# Altium project VOM.PrjPCB
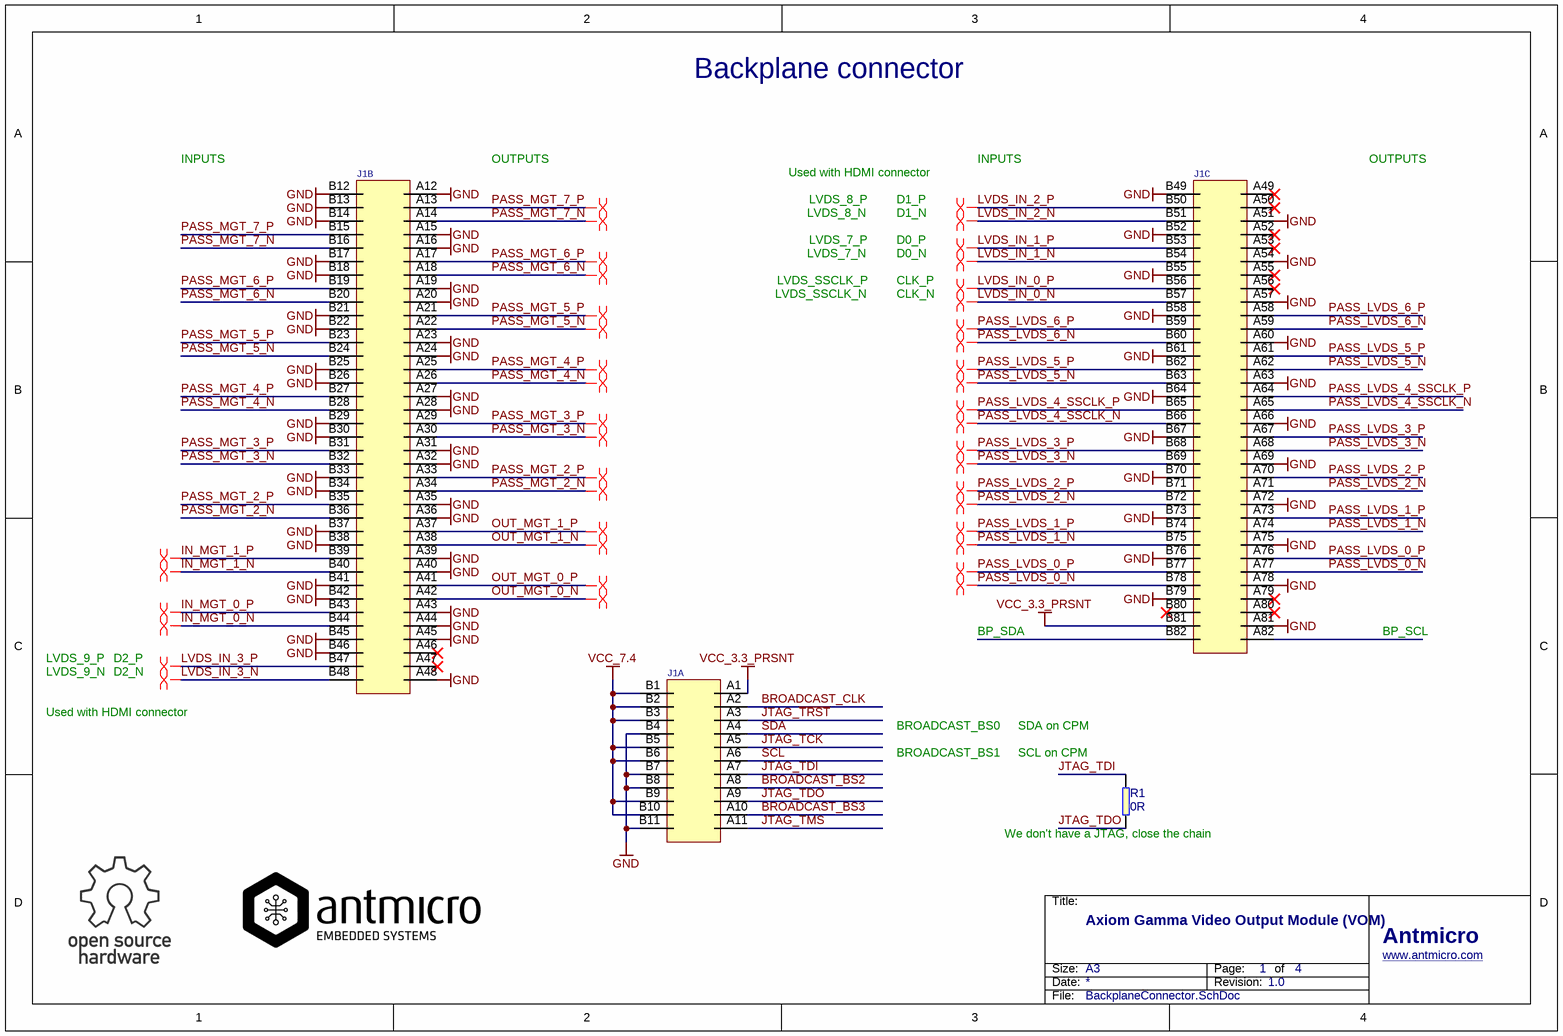
[diagram p0: BackplaneConnector.SchDoc]
AM_Author: H. Szwed, P. Katarzynski, M. Majchrzycki; AM_Revision: 1.0; AM_Title: Axiom Gamma Video Output Module (VOM)
4 sheets, 103 parts. Net scope: global (net labels, ports and power ports of the same name join across sheets).
Board file: PCB.PcbDoc
Sheets:
  BackplaneConnector.SchDoc
  Supplies.SchDoc
  HDMI.SchDoc
  SDI.SchDoc

## Sheet BackplaneConnector.SchDoc
size A4; DocumentNumber: 1; SheetNumber: 1; SheetTotal: 4; PageSetup: Record=PageOptions|CenterHorizontal=True|CenterVertical=True|PrintScale=0.97|XCorrection=1.00|YCorrection=1.00|PrintKind=1|BorderSize=5000000|LeftOffset=0|BottomOffset=0|Orientation=2|PaperLength=2970|PaperWidth=2100|Scale=100|PaperSource=7|PrintQuality=600|MediaType=1|DitherType=10|PaperKind=A4|PrintScaleMode=1

### Parts
J1  (no value)  [PCIEX16]  (parts A,B,C of 3)  (no BOM)
R1  0R  [0402]

### Nets
GND: J1.A12 J1.A15 J1.A16 J1.A19 J1.A20 J1.A23 J1.A24 J1.A27 J1.A28 J1.A31 J1.A32 J1.A35 J1.A36 J1.A39 J1.A40 J1.A43 J1.A44 J1.A45 J1.A48 J1.A51 J1.A54 J1.A57 J1.A60 J1.A63 J1.A66 J1.A69 J1.A72 J1.A75 J1.A78 J1.A81 J1.B4 J1.B7 J1.B8 J1.B11 J1.B12 J1.B13 J1.B14 J1.B17 J1.B18 J1.B21 J1.B22 J1.B25 J1.B26 J1.B29 J1.B30 J1.B33 J1.B34 J1.B37 J1.B38 J1.B41 J1.B42 J1.B45 J1.B46 J1.B49 J1.B52 J1.B55 J1.B58 J1.B61 J1.B64 J1.B67 J1.B70 J1.B73 J1.B76 J1.B79
VCC_3.3_PRSNT: J1.A1 J1.B81
VCC_7.4: J1.B1 J1.B2 J1.B3 J1.B5 J1.B6 J1.B9 J1.B10
BROADCAST_BS2: J1.A8
BROADCAST_BS3: J1.A10
BROADCAST_CLK: J1.A2
IN_MGT_0_N: J1.B44
IN_MGT_0_P: J1.B43
IN_MGT_1_N: J1.B40
IN_MGT_1_P: J1.B39
JTAG_~{TRST}: J1.A3
JTAG_TCK: J1.A5
JTAG_TDI: J1.A7 R1.2
JTAG_TDO: J1.A9 R1.1
JTAG_TMS: J1.A11
LVDS_IN_0_N: J1.B57
LVDS_IN_0_P: J1.B56
LVDS_IN_1_N: J1.B54
LVDS_IN_1_P: J1.B53
LVDS_IN_2_N: J1.B51
LVDS_IN_2_P: J1.B50
LVDS_IN_3_N: J1.B48
LVDS_IN_3_P: J1.B47
OUT_MGT_0_N: J1.A42
OUT_MGT_0_P: J1.A41
OUT_MGT_1_N: J1.A38
OUT_MGT_1_P: J1.A37
PASS_LVDS_0_N: J1.A77 J1.B78
PASS_LVDS_0_P: J1.A76 J1.B77
PASS_LVDS_1_N: J1.A74 J1.B75
PASS_LVDS_1_P: J1.A73 J1.B74
PASS_LVDS_2_N: J1.A71 J1.B72
PASS_LVDS_2_P: J1.A70 J1.B71
PASS_LVDS_3_N: J1.A68 J1.B69
PASS_LVDS_3_P: J1.A67 J1.B68
PASS_LVDS_4_SSCLK_N: J1.A65 J1.B66
PASS_LVDS_4_SSCLK_P: J1.A64 J1.B65
PASS_LVDS_5_N: J1.A62 J1.B63
PASS_LVDS_5_P: J1.A61 J1.B62
PASS_LVDS_6_N: J1.A59 J1.B60
PASS_LVDS_6_P: J1.A58 J1.B59
PASS_MGT_2_N: J1.A34 J1.B36
PASS_MGT_2_P: J1.A33 J1.B35
PASS_MGT_3_N: J1.A30 J1.B32
PASS_MGT_3_P: J1.A29 J1.B31
PASS_MGT_4_N: J1.A26 J1.B28
PASS_MGT_4_P: J1.A25 J1.B27
PASS_MGT_5_N: J1.A22 J1.B24
PASS_MGT_5_P: J1.A21 J1.B23
PASS_MGT_6_N: J1.A18 J1.B20
PASS_MGT_6_P: J1.A17 J1.B19
PASS_MGT_7_N: J1.A14 J1.B16
PASS_MGT_7_P: J1.A13 J1.B15
SCL: J1.A6
SDA: J1.A4

Not connected (* = marked no-connect by the designer): J1 A46* A47* A49* A50* A52* A53* A55* A56* A79* A80* A82 B80* B82

### Layout directives
differential pair: IN_MGT_0_N, IN_MGT_0_P, IN_MGT_1_N, IN_MGT_1_P, LVDS_IN_0_N, LVDS_IN_0_P, LVDS_IN_1_N, LVDS_IN_1_P, LVDS_IN_2_N, LVDS_IN_2_P, LVDS_IN_3_N, LVDS_IN_3_P, OUT_MGT_0_N, OUT_MGT_0_P, OUT_MGT_1_N, OUT_MGT_1_P, PASS_LVDS_0_N, PASS_LVDS_0_P, PASS_LVDS_1_N, PASS_LVDS_1_P, PASS_LVDS_2_N, PASS_LVDS_2_P, PASS_LVDS_3_N, PASS_LVDS_3_P, PASS_LVDS_4_SSCLK_N, PASS_LVDS_4_SSCLK_P, PASS_LVDS_5_N, PASS_LVDS_5_P, PASS_LVDS_6_N, PASS_LVDS_6_P, PASS_MGT_2_N, PASS_MGT_2_P, PASS_MGT_3_N, PASS_MGT_3_P, PASS_MGT_4_N, PASS_MGT_4_P, PASS_MGT_5_N, PASS_MGT_5_P, PASS_MGT_6_N, PASS_MGT_6_P, PASS_MGT_7_N, PASS_MGT_7_P

### Notes on the sheet
- Backplane connector
- INPUTS
- OUTPUTS
- Used with HDMI connector
- LVDS_8_N
- LVDS_8_P
- LVDS_7_P
- D1_N
- D1_P
- D0_P
- LVDS_SSCLK_N
- LVDS_SSCLK_P
- LVDS_7_N
- CLK_N
- CLK_P
- D0_N
- BP_SDA
- BP_SCL
- LVDS_9_P
- LVDS_9_N
- D2_P
- D2_N
- BROADCAST_BS0
- BROADCAST_BS1
- SDA on CPM
- SCL on CPM
- (near R1) We don't have a JTAG, close the chain
- Title:
- Size:
- Date:
- A3
- Revision:
- Page:
- of
- Antmicro
- www.antmicro.com
- File:

### Library data of the parts
J1 = PCIEX16: PCB Only; Part Number: PCIEX16; Manufacturer: PCB ONLY; Part Symbol: PCB ONLY
R1 = R_0R_0402: SMT Resistor 0402; Manufacturer: MULTICOMP; Part Symbol: MCMR04X000 PTL; Value: 0R; Part Number: R_0R_0402

## Sheet Supplies.SchDoc
size A4; DocumentNumber: 2; SheetNumber: 2; SheetTotal: 4; PageSetup: Record=PageOptions|CenterHorizontal=True|CenterVertical=True|PrintScale=0.97|XCorrection=1.00|YCorrection=1.00|PrintKind=1|BorderSize=5000000|LeftOffset=0|BottomOffset=0|Orientation=2|PaperLength=2970|PaperWidth=2100|Scale=100|PaperSource=7|PrintQuality=600|MediaType=1|DitherType=10|PaperKind=A4|PrintScaleMode=1
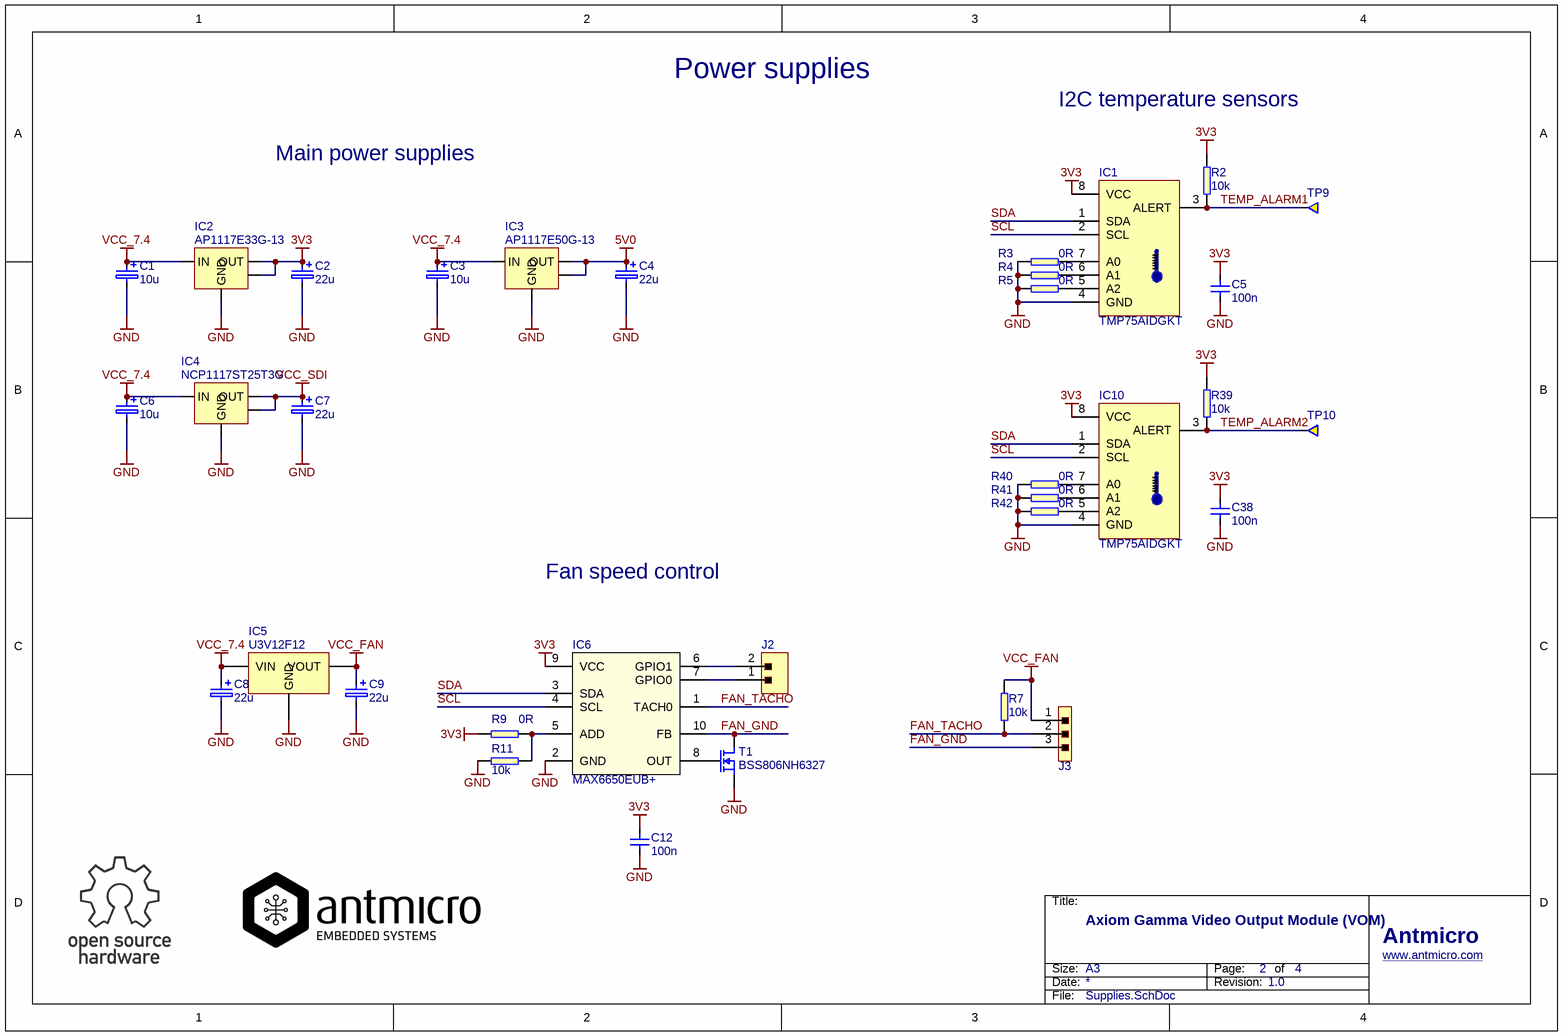
[diagram p1: Supplies.SchDoc]

### Parts
C1  10u  [KEMET_C]
C2  22u  [KEMET_C]
C3  10u  [KEMET_C]
C4  22u  [KEMET_C]
C5  100n  [0402]
C6  10u  [KEMET_C]
C7  22u  [KEMET_C]
C8  22u  [KEMET_C]
C9  22u  [KEMET_C]
C12  100n  [0402]
C38  100n  [0402]
IC1  TMP75AIDGKT  [MSOP-8]
IC2  AP1117E33G-13  [SOT223]
IC3  AP1117E50G-13  [SOT223]
IC4  NCP1117ST25T3G  [SOT223]
IC5  U3V12F12  [U3V12Fxx]
IC6  MAX6650EUB+  [uMAX10]
IC10  TMP75AIDGKT  [MSOP-8]
J2  MH_1X02_2.54  [MH_1X02_2.54]  (value not drawn)
J3  Molex 022232031  [molex_2223-2031]  (value not drawn)
R2  10k  [0402]
R3  0R  [0603]
R4  0R  [0603]
R5  0R  [0603]
R7  10k  [0402]
R9  0R  [0603]
R11  10k  [0603]
R39  10k  [0402]
R40  0R  [0603]
R41  0R  [0603]
R42  0R  [0603]
T1  BSS806NH6327  [SOT-23]
TP9  Testpad  [Testpad]  (value not drawn)  (no BOM)
TP10  Testpad  [Testpad]  (value not drawn)  (no BOM)

### Nets
3V3: C2.1 C5.1 C12.1 C38.1 IC1.8(VCC) IC2.2(OUT) IC2.4(OUT) IC6.9(VCC) IC10.8(VCC) R2.2 R9.1 R39.2
5V0: C4.1 IC3.2(OUT) IC3.4(OUT)
GND: C1.2 C2.2 C3.2 C4.2 C5.2 C6.2 C7.2 C8.2 C9.2 C12.2 C38.2 IC1.4(GND) IC2.1(GND) IC3.1(GND) IC4.1(GND) IC5.2(GND) IC6.2(GND) IC10.4(GND) R3.2 R4.2 R5.2 R11.1 R40.2 R41.2 R42.2 T1.2(S)
VCC_7.4: C1.1 C3.1 C6.1 C8.1 IC2.3(IN) IC3.3(IN) IC4.3(IN) IC5.1(VIN)
VCC_FAN: C9.1 IC5.3(VOUT) J3.1 R7.2
VCC_SDI: C7.1 IC4.2(OUT) IC4.4(OUT)
FAN_GND: IC6.10(FB) J3.3 T1.3(D)
FAN_TACHO: IC6.1(TACH0) J3.2 R7.1
SCL: IC1.2(SCL) IC6.4(SCL) IC10.2(SCL)
SDA: IC1.1(SDA) IC6.3(SDA) IC10.1(SDA)
TEMP_ALARM1: IC1.3(ALERT) R2.1 TP9.1
TEMP_ALARM2: IC10.3(ALERT) R39.1 TP10.1
NetIC1_5: IC1.5(A2) R5.1
NetIC1_6: IC1.6(A1) R4.1
NetIC1_7: IC1.7(A0) R3.1
NetIC6_5: IC6.5(ADD) R9.2 R11.2
NetIC6_6: IC6.6(GPIO1) J2.2
NetIC6_7: IC6.7(GPIO0) J2.1
NetIC6_8: IC6.8(OUT) T1.1(G)
NetIC10_5: IC10.5(A2) R42.1
NetIC10_6: IC10.6(A1) R41.1
NetIC10_7: IC10.7(A0) R40.1

### Notes on the sheet
- Power supplies
- I2C temperature sensors
- Main power supplies
- Fan speed control
- Title:
- Size:
- Date:
- A3
- Revision:
- Page:
- of
- Antmicro
- www.antmicro.com
- File:

### Library data of the parts
C1 C3 C6 = CPol_10u: Tantalum SMT Capacitor 10uF Case KEMET_C; Part Number: C_10u_KEMET_C; Manufacturer: KEMET; Part Symbol: T491C106K025AT; Value: 10u
C2 C4 C7-C9 = CPol_22u: Tantalum SMT Capacitor 22uF Case KEMET_C; Part Number: C_22u_KEMET_C; Manufacturer: KEMET; Part Symbol: T491C226K025AT; Value: 22u
C5 C12 C38 = C_100n_0402: MLCC SMT Capacitor 0402; Manufacturer: MULTICOMP; Part Symbol: MC0402X104M100CT; Value: 100n; Part Number: C_100n_0402
IC1 IC10 = TMP75: Temperature Sensor With I2C and SMBus Interface in Industry Standard LM75; Manufacturer: TEXAS INSTRUMENTS; Part Number: TMP75AIDGKT; Value: TMP75AIDGKT; Part Symbol: TMP75AIDGKT
IC2 = AP1117E33G-13: IC, LDO, REG, 3.3V, SOT223; Manufacturer: DIODES INC.; Value: AP1117E33G-13; Part Number: AP1117E33G-13; Part Symbol: AP1117E33G-13
IC3 = AP1117E50G-13: IC, LDO, REG, 5.0V, SOT223; Manufacturer: DIODES INC.; Value: AP1117E50G-13; Part Number: AP1117E50G-13; Part Symbol: AP1117E50G-13
IC4 = NCP1117ST25T3G: IC, LDO, REG, 2.5V, SOT223; Manufacturer: ON Semiconductor; Value: NCP1117ST25T3G; Part Number: NCP1117ST25T3G; Part Symbol: NCP1117ST25T3G
IC5 = U3V12F12: Pololu 9V Step-Up Voltage Regulator; Manufacturer: TME; Part Symbol: POLOLU-2117 / POLOLU-2117; Part Number: U3V12F12; Value: U3V12F12
IC6 = MAX6650: Fan-Speed Regulator and Monitor with SMBus/I2C-Compatible Interface; Manufacturer: MAXIM INTEGRATED; Part Number: MAX6650EUB+; Value: MAX6650EUB+; Part Symbol: MAX6650EUB+
J2 = 1X02: Male header, 1 x 02 pins, pitch 2.54 mm; Manufacturer: MULTICOMP; Part Symbol: 2211S-02G; Part Number: MH_1X02_2.54; Value: MH_1X02_2.54
J3 = 1X03: Part Number: molex_2223-2031; Value: Molex 022232031; Manufacturer: Molex; Part Symbol: 22-23-2031
R2 R7 R39 = R_10k_0402: SMT Resistor 0402; Manufacturer: MULTICOMP; Part Symbol: MCMR04X1002FTL; Value: 10k; Part Number: R_10k_0402
R3-R5 R9 R40-R42 = R_0R_0603: SMT Resistor 0R 0603; Manufacturer: BOURNS; Part Symbol: CR0603-J/-000ELF; Value: 0R; Part Number: R_0R_0603
R11 = R_10k_0603: SMT Resistor 0R 0603; Manufacturer: BOURNS; Part Symbol: CR0603-JW-103ELF; Value: 10k; Part Number: R_10k_0603
T1 = BSS806NH6327: MOSFET, BRT, N CH, 2.3 A, 20 V, 0.041 ohm, 2.5 V, 550 mV; Manufacturer: INFINEON; Part Symbol: BSS806NH6327XTSA1; Value: BSS806NH6327; Part Number: BSS806NH6327
TP9 TP10 = Testpad: Testpad 2mm diameter; Manufacturer: PCB ONLY; Part Number: Testpad; Part Symbol: PCB ONLY

## Sheet HDMI.SchDoc
size A4; DocumentNumber: 3; SheetNumber: 3; SheetTotal: 4; PageSetup: Record=PageOptions|CenterHorizontal=True|CenterVertical=True|PrintScale=0.97|XCorrection=1.00|YCorrection=1.00|PrintKind=1|BorderSize=5000000|LeftOffset=0|BottomOffset=0|Orientation=2|PaperLength=2970|PaperWidth=2100|Scale=100|PaperSource=7|PrintQuality=600|MediaType=1|DitherType=10|PaperKind=A4|PrintScaleMode=1
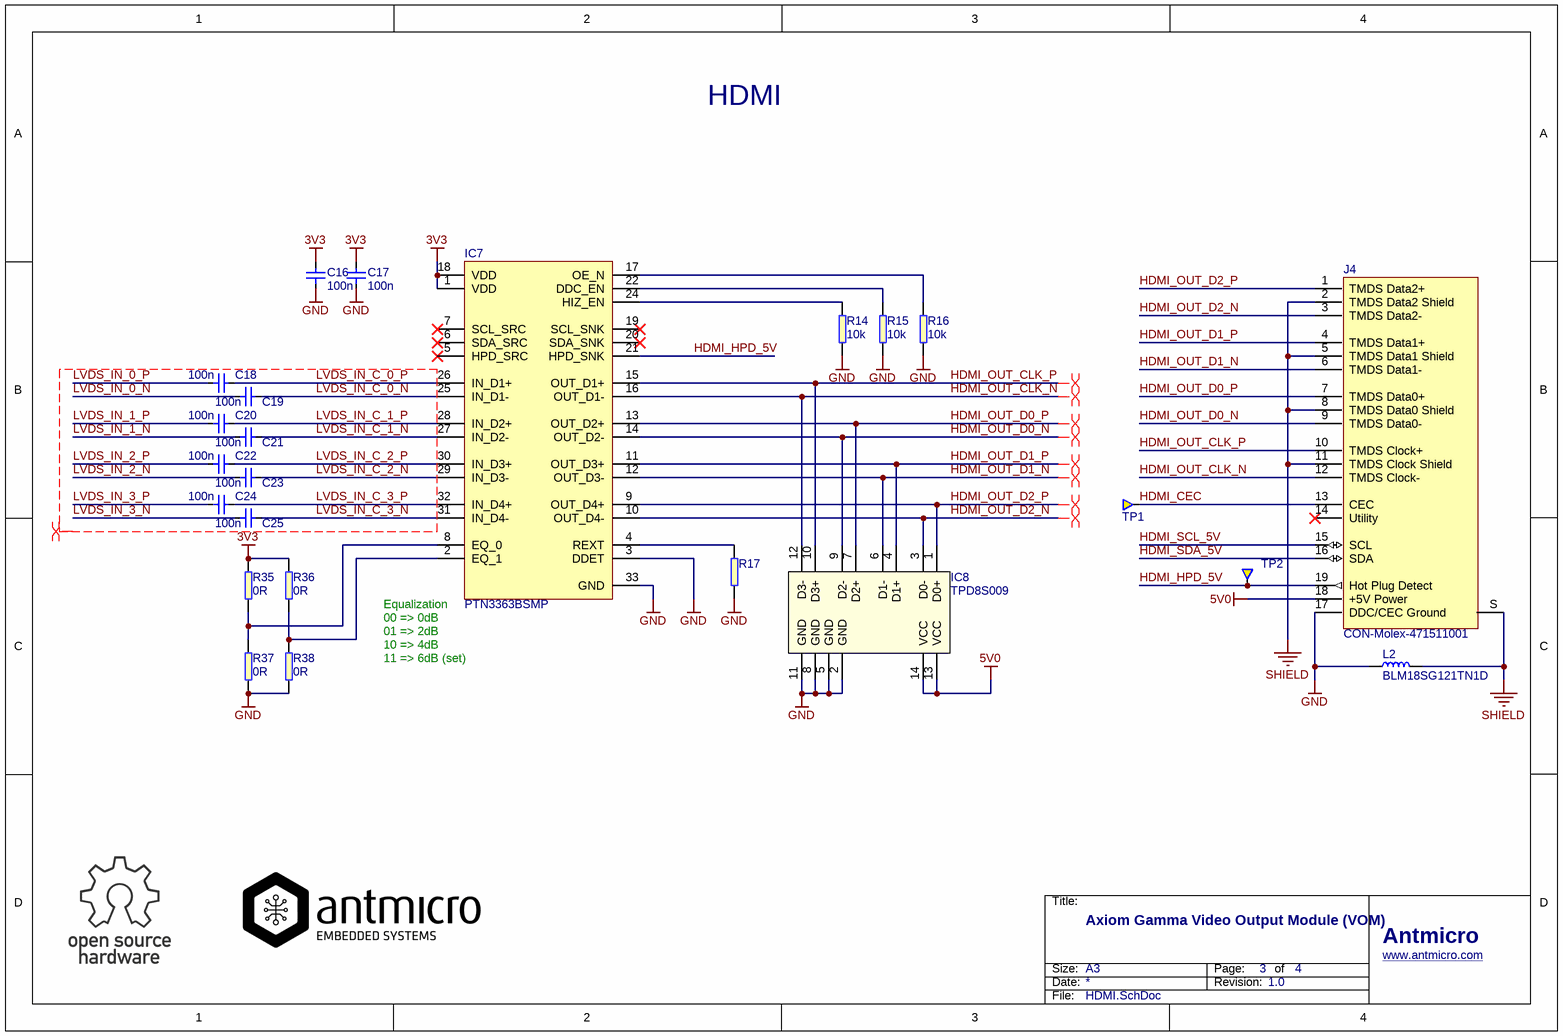
[diagram p2: HDMI.SchDoc]

### Parts
C16  100n  [0402]
C17  100n  [0402]
C18  100n  [0402]
C19  100n  [0402]
C20  100n  [0402]
C21  100n  [0402]
C22  100n  [0402]
C23  100n  [0402]
C24  100n  [0402]
C25  100n  [0402]
IC7  PTN3363BSMP  [QFN-32]
IC8  TPD8S009  [SON-15]
J4  CON-Molex-471511001  [Molex_HDMI_471511001]
L2  BLM18SG121TN1D  [0603]
R14  10k  [0402]
R15  10k  [0402]
R16  10k  [0402]
R17  12k4  [0402]  (value not drawn)
R35  0R  [0603]
R36  0R  [0603]
R37  0R  [0603]
R38  0R  [0603]
TP1  Testpad  [Testpad]  (value not drawn)  (no BOM)
TP2  Testpad  [Testpad]  (value not drawn)  (no BOM)

### Nets
3V3: C16.2 C17.2 IC7.1(VDD) IC7.18(VDD) R35.1 R36.1
5V0: IC8.13(VCC) IC8.14(VCC) J4.18(+5V_Power)
GND: C16.1 C17.1 IC7.3(DDET) IC7.33(GND) IC8.2(GND) IC8.5(GND) IC8.8(GND) IC8.11(GND) J4.17(DDC/CEC_Ground) L2.1 R14.2 R15.2 R16.2 R17.1 R37.2 R38.2
SHIELD: J4.2(TMDS_Data2_Shield) J4.5(TMDS_Data1_Shield) J4.8(TMDS_Data0_Shield) J4.11(TMDS_Clock_Shield) J4.S(SH) L2.2
HDMI_CEC: J4.13(CEC) TP1.1
HDMI_HPD_5V: IC7.21(HPD_SNK) J4.19(Hot_Plug_Detect) TP2.1
HDMI_OUT_CLK_N: IC7.16(OUT_D1-) IC8.12(D3-) J4.12(TMDS_Clock-)
HDMI_OUT_CLK_P: IC7.15(OUT_D1+) IC8.10(D3+) J4.10(TMDS_Clock+)
HDMI_OUT_D0_N: IC7.14(OUT_D2-) IC8.9(D2-) J4.9(TMDS_Data0-)
HDMI_OUT_D0_P: IC7.13(OUT_D2+) IC8.7(D2+) J4.7(TMDS_Data0+)
HDMI_OUT_D1_N: IC7.12(OUT_D3-) IC8.6(D1-) J4.6(TMDS_Data1-)
HDMI_OUT_D1_P: IC7.11(OUT_D3+) IC8.4(D1+) J4.4(TMDS_Data1+)
HDMI_OUT_D2_N: IC7.10(OUT_D4-) IC8.3(D0-) J4.3(TMDS_Data2-)
HDMI_OUT_D2_P: IC7.9(OUT_D4+) IC8.1(D0+) J4.1(TMDS_Data2+)
HDMI_SCL_5V: J4.15(SCL)
HDMI_SDA_5V: J4.16(SDA)
LVDS_IN_0_N: C19.1
LVDS_IN_0_P: C18.1
LVDS_IN_1_N: C21.1
LVDS_IN_1_P: C20.1
LVDS_IN_2_N: C23.1
LVDS_IN_2_P: C22.1
LVDS_IN_3_N: C25.1
LVDS_IN_3_P: C24.1
LVDS_IN_C_0_N: C19.2 IC7.25(IN_D1-)
LVDS_IN_C_0_P: C18.2 IC7.26(IN_D1+)
LVDS_IN_C_1_N: C21.2 IC7.27(IN_D2-)
LVDS_IN_C_1_P: C20.2 IC7.28(IN_D2+)
LVDS_IN_C_2_N: C23.2 IC7.29(IN_D3-)
LVDS_IN_C_2_P: C22.2 IC7.30(IN_D3+)
LVDS_IN_C_3_N: C25.2 IC7.31(IN_D4-)
LVDS_IN_C_3_P: C24.2 IC7.32(IN_D4+)
NetIC7_2: IC7.2(EQ_1) R36.2 R38.1
NetIC7_4: IC7.4(REXT) R17.2
NetIC7_8: IC7.8(EQ_0) R35.2 R37.1
NetIC7_17: IC7.17(OE_N) R16.1
NetIC7_22: IC7.22(DDC_EN) R15.1
NetIC7_24: IC7.24(HIZ_EN) R14.1

Not connected (* = marked no-connect by the designer): IC7 5(HPD_SRC)* 6(SDA_SRC)* 7(SCL_SRC)* 19(SCL_SNK)* 20(SDA_SNK)*; J4 14(Utility)*

### Layout directives
differential pair: HDMI_OUT_CLK_N, HDMI_OUT_CLK_P, HDMI_OUT_D0_N, HDMI_OUT_D0_P, HDMI_OUT_D1_N, HDMI_OUT_D1_P, HDMI_OUT_D2_N, HDMI_OUT_D2_P, LVDS_IN_0_N, LVDS_IN_0_P, LVDS_IN_1_N, LVDS_IN_1_P, LVDS_IN_2_N, LVDS_IN_2_P, LVDS_IN_3_N, LVDS_IN_3_P, LVDS_IN_C_0_N, LVDS_IN_C_0_P, LVDS_IN_C_1_N, LVDS_IN_C_1_P, LVDS_IN_C_2_N, LVDS_IN_C_2_P, LVDS_IN_C_3_N, LVDS_IN_C_3_P

### Notes on the sheet
- HDMI
- (near IC7) 00 => 0dB
- (near IC7) 01 => 2dB
- 10 => 4dB
- (near IC7) Equalization
- 11 => 6dB (set)
- Title:
- Size:
- Date:
- A3
- Revision:
- Page:
- of
- Antmicro
- www.antmicro.com
- File:

### Library data of the parts
C16-C25 = C_100n_0402: as C5 on sheet Supplies; Value: 100n; Part Number: C_100n_0402
IC7 = PTN3363: HDMI level shifter; Manufacturer: NXP; Part Number: PTN3363BSMP; Value: PTN3363BSMP; Part Symbol: PTN3363BSMP
IC8 = TPD8S009: 8-Channel ESD Protection for DisplayPort and HDMI; Manufacturer: TEXAS INSTRUMENTS; Part Symbol: TPD8S009DSMR; Part Number: TPD8S009; Value: TPD8S009
J4 = CON-Molex-471511001: Header right angle HDMI; Manufacturer: MOLEX; Value: 47151-1001; Part Number: CON-Molex-471511001; Part Symbol: 47151-1001
L2 = Inductor SMT: FERRITE BEAD, 0.025OHM, 3A, 0603; Manufacturer: MURATA; Part Number: BLM18SG121TN1D; Value: BLM18SG121TN1D; Part Symbol: BLM18SG121TN1D
R14-R16 = R_10k_0402: as R2 on sheet Supplies; Value: 10k; Part Number: R_10k_0402
R17 = R_12k4_0402_1%: SMT Resistor 12k4 0402 1%; Manufacturer: MULTICOMP; Part Symbol: MC00625W0402112K4; Value: 12k4; Part Number: R_12k4_0402_1%
R35-R38 = R_0R_0603: as R3 on sheet Supplies; Value: 0R; Part Number: R_0R_0603
TP1 TP2 = Testpad: as TP9 on sheet Supplies; Part Number: Testpad; Part Symbol: PCB ONLY

## Sheet SDI.SchDoc
size A4; DocumentNumber: 4; SheetNumber: 4; SheetTotal: 4; PageSetup: Record=PageOptions|CenterHorizontal=True|CenterVertical=True|PrintScale=0.97|XCorrection=1.00|YCorrection=1.00|PrintKind=1|BorderSize=5000000|LeftOffset=0|BottomOffset=0|Orientation=2|PaperLength=2970|PaperWidth=2100|Scale=100|PaperSource=7|PrintQuality=600|MediaType=1|DitherType=10|PaperKind=A4|PrintScaleMode=1
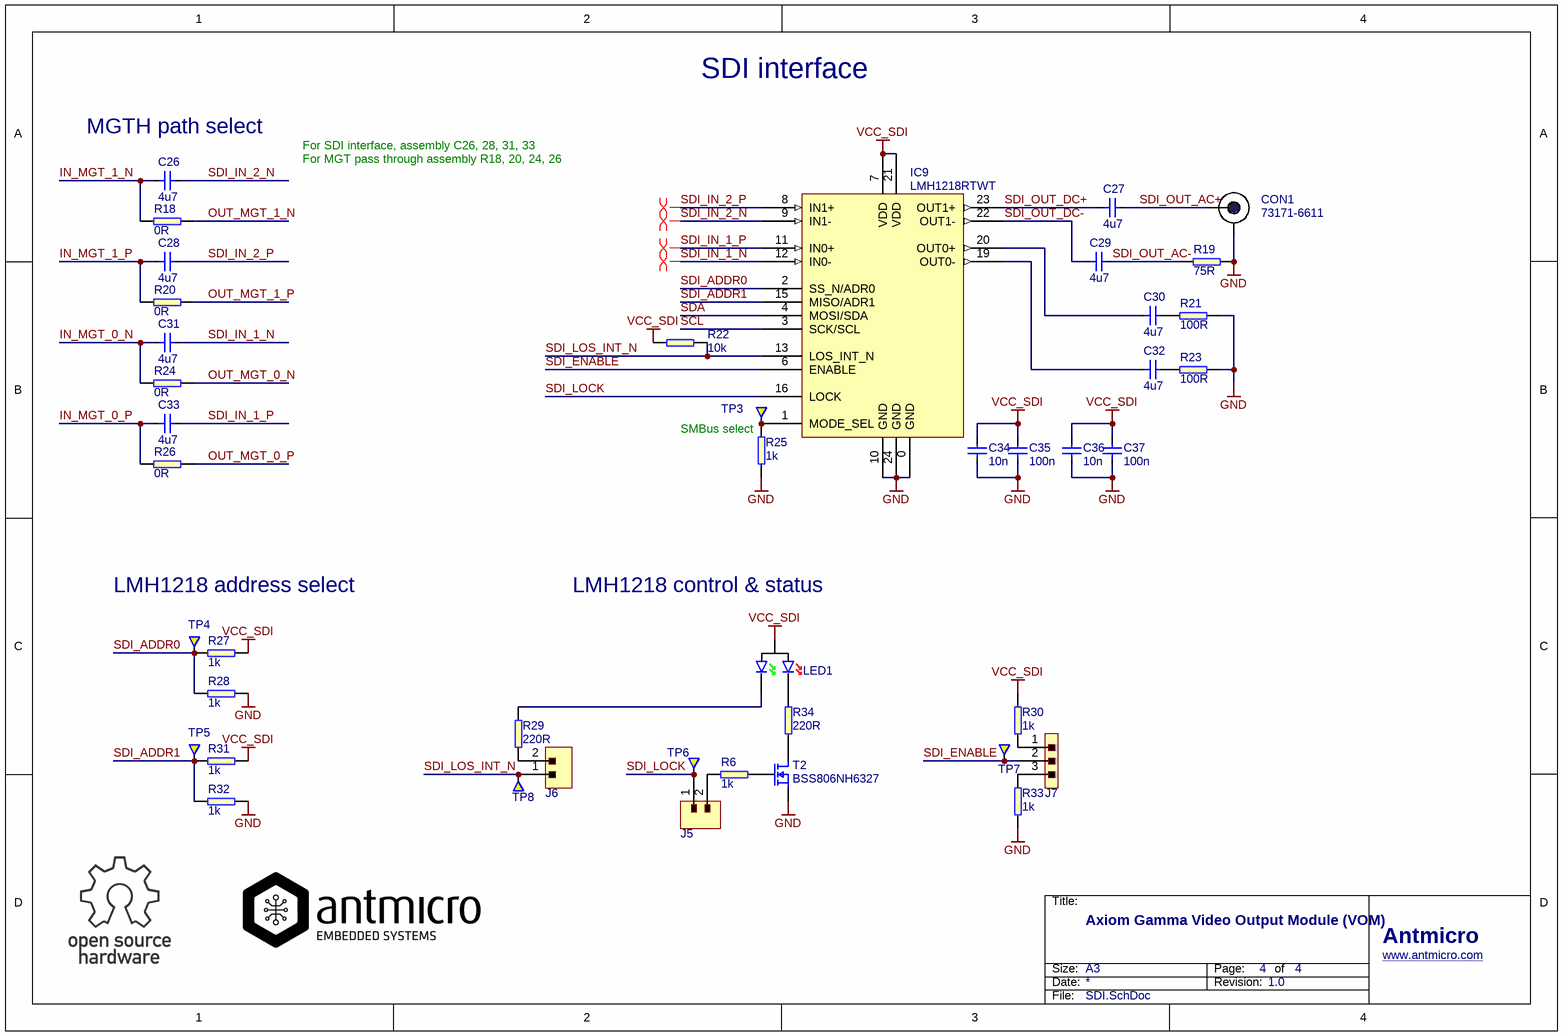
[diagram p3: SDI.SchDoc]

### Parts
C26  4u7  [0402]
C27  4u7  [0402]
C28  4u7  [0402]
C29  4u7  [0402]
C30  4u7  [0402]
C31  4u7  [0402]
C32  4u7  [0402]
C33  4u7  [0402]
C34  10n  [0402]
C35  100n  [0402]
C36  10n  [0402]
C37  100n  [0402]
CON1  73171-6611  [MOLEX_BNC_73171-6611]
IC9  LMH1218RTWT  [WQFN-24]
J5  MH_1X02_2.54  [MH_1X02_2.54]  (value not drawn)
J6  MH_1X02_2.54  [MH_1X02_2.54]  (value not drawn)
J7  MH_1X03_2.54  [MH_1X03_2.54]  (value not drawn)
LED1  LED-LiteON-LTST-S326KGJRKT  [LED-LiteON-LTST-S326KGJRKT]  (value not drawn)
R6  1k  [0603]
R18  0R  [0402]
R19  75R  [0402]
R20  0R  [0402]
R21  100R  [0402]
R22  10k  [0402]
R23  100R  [0402]
R24  0R  [0402]
R25  1k  [0402]
R26  0R  [0402]
R27  1k  [0603]
R28  1k  [0603]
R29  220R  [0402]
R30  1k  [0603]
R31  1k  [0603]
R32  1k  [0603]
R33  1k  [0603]
R34  220R  [0402]
T2  BSS806NH6327  [SOT-23]
TP3  Testpad  [Testpad]  (value not drawn)  (no BOM)
TP4  Testpad  [Testpad]  (value not drawn)  (no BOM)
TP5  Testpad  [Testpad]  (value not drawn)  (no BOM)
TP6  Testpad  [Testpad]  (value not drawn)  (no BOM)
TP7  Testpad  [Testpad]  (value not drawn)  (no BOM)
TP8  Testpad  [Testpad]  (value not drawn)  (no BOM)

### Nets
GND: C34.1 C35.1 C36.1 C37.1 CON1.S IC9.0(GND) IC9.10(GND) IC9.24(GND) R19.1 R21.1 R23.1 R25.1 R28.2 R32.2 R33.2 T2.2(S)
VCC_SDI: C34.2 C35.2 C36.2 C37.2 IC9.7(VDD) IC9.21(VDD) LED1.A R22.1 R27.2 R30.1 R31.2
IN_MGT_0_N: C31.1 R24.1
IN_MGT_0_P: C33.1 R26.1
IN_MGT_1_N: C26.1 R18.1
IN_MGT_1_P: C28.1 R20.1
OUT_MGT_0_N: R24.2
OUT_MGT_0_P: R26.2
OUT_MGT_1_N: R18.2
OUT_MGT_1_P: R20.2
SCL: IC9.3(SCK/SCL)
SDA: IC9.4(MOSI/SDA)
SDI_ADDR0: IC9.2(SS_N/ADR0) R27.1 R28.1 TP4.1
SDI_ADDR1: IC9.15(MISO/ADR1) R31.1 R32.1 TP5.1
SDI_ENABLE: IC9.6(ENABLE) J7.2 TP7.1
SDI_IN_1_N: C31.2 IC9.12(IN0-)
SDI_IN_1_P: C33.2 IC9.11(IN0+)
SDI_IN_2_N: C26.2 IC9.9(IN1-)
SDI_IN_2_P: C28.2 IC9.8(IN1+)
SDI_LOCK: IC9.16(LOCK) J5.1 TP6.1
SDI_LOS_INT_N: IC9.13(LOS_INT_N) J6.1 R22.2 TP8.1
SDI_OUT_AC+: C27.2 CON1.1
SDI_OUT_AC-: C29.2 R19.2
SDI_OUT_DC+: C27.1 IC9.23(OUT1+)
SDI_OUT_DC-: C29.1 IC9.22(OUT1-)
NetC30_1: C30.1 IC9.20(OUT0+)
NetC30_2: C30.2 R21.2
NetC32_1: C32.1 IC9.19(OUT0-)
NetC32_2: C32.2 R23.2
NetIC9_1: IC9.1(MODE_SEL) R25.2 TP3.1
NetJ5_2: J5.2 R6.1
NetJ6_2: J6.2 R29.2
NetJ7_1: J7.1 R30.2
NetJ7_3: J7.3 R33.1
NetLED1_C1: LED1.C1 R34.2
NetLED1_C2: LED1.C2 R29.1
NetR6_2: R6.2 T2.1(G)
NetR34_1: R34.1 T2.3(D)

### Layout directives
differential pair: SDI_IN_1_N, SDI_IN_1_P, SDI_IN_2_N, SDI_IN_2_P

### Notes on the sheet
- SDI interface
- (near C26) MGTH path select
- For SDI interface, assembly C26, 28, 31, 33
- For MGT pass through assembly R18, 20, 24, 26
- SMBus select
- LMH1218 address select
- LMH1218 control & status
- Title:
- Size:
- Date:
- A3
- Revision:
- Page:
- of
- Antmicro
- www.antmicro.com
- File:

### Library data of the parts
C26-C33 = C_4u7_0402: MLCC SMT Capacitor 0402; Manufacturer: MURATA; Part Symbol: GRM155R60G475ME; Value: 4u7; Part Number: C_4u7_0402
C34 C36 = C_10n_0402: MLCC SMT Capacitor 0402; Manufacturer: AVX; Part Symbol: 04025G103ZAT2A; Value: 10n; Part Number: C_10n_0402
C35 C37 = C_100n_0402: as C5 on sheet Supplies; Value: 100n; Part Number: C_100n_0402
CON1 = MOLEX_BNC_73171-6611: Manufacturer: MOLEX; Part Number: MOLEX_BNC_73171-6611; Value: 73171-6611; Part Symbol: 73171-6611
IC9 = LMH1218: Low Power Ultra HD Cable Driver with Integrated Reclocker; Manufacturer: TEXAS INSTRUMENTS; Part Number: LMH1218RTWT; Value: LMH1218RTWT; Part Symbol: LMH1218RTWT
J5 J6 = 1X02: as J2 on sheet Supplies; Part Number: MH_1X02_2.54; Value: MH_1X02_2.54
J7 = 1X03_1: Male header, 1 x 03 pins, pitch 2.54 mm; Manufacturer: HARWIN; Part Symbol: M20-9990345.; Part Number: MH_1X03_2.54; Value: MH_1X03_2.54
LED1 = LED-LiteON-LTST-S326KGJRKT: Standard LEDs - SMD Green/Red Clear 571nm/631nm; Manufacturer: Lite-On; Part Number: LED-LiteON-LTST-S326KGJRKT; Value: LED-LiteON-LTST-S326KGJRKT; Part Symbol: LTST-S326KGJRKT
R6 R27 R28 R30-R33 = R_1k_0603: SMT Resistor 0R 0603; Manufacturer: BOURNS; Part Symbol: CR0603-JW-102ELF; Value: 1k; Part Number: R_1k_0603
R18 R20 R24 R26 = R_0R_0402: as R1 on sheet BackplaneConnector; Value: 0R; Part Number: R_0R_0402
R19 = R_75R_0402: SMT Resistor 0402; Manufacturer: YAGEO(PHYCOMP); Part Symbol: RC0402FR-0775RL; Value: 75R; Part Number: R_75R_0402
R21 R23 = R_100R_0402: SMT Resistor 0402; Manufacturer: BOURNS; Part Symbol: CR0402-FX-1000GLF; Value: 100R; Part Number: R_100R_0402
R22 = R_10k_0402: as R2 on sheet Supplies; Value: 10k; Part Number: R_10k_0402
R25 = R_1k_0402: SMT Resistor 0402; Manufacturer: MULTICOMP; Part Symbol: MCMR04X1001FTL; Value: 1k; Part Number: R_1k_0402
R29 R34 = R_220R_0402: SMT Resistor 0402; Manufacturer: TE CONNECTIVITY; Part Symbol: CRG0402J220R; Value: 220R; Part Number: R_220R_0402
T2 = BSS806NH6327: as T1 on sheet Supplies; Value: BSS806NH6327; Part Number: BSS806NH6327
TP3-TP8 = Testpad: as TP9 on sheet Supplies; Part Number: Testpad; Part Symbol: PCB ONLY

## Nets that join several sheets
3V3: Supplies (12 pins), HDMI (6 pins)
5V0: Supplies (C4.1 IC3.2 IC3.4), HDMI (IC8.13 IC8.14 J4.18)
GND: BackplaneConnector (64 pins), Supplies (26 pins), HDMI (16 pins), SDI (16 pins)
VCC_7.4: BackplaneConnector (7 pins), Supplies (8 pins)
VCC_SDI: Supplies (C7.1 IC4.2 IC4.4), SDI (11 pins)
IN_MGT_0_N: BackplaneConnector (J1.B44), SDI (C31.1 R24.1)
IN_MGT_0_P: BackplaneConnector (J1.B43), SDI (C33.1 R26.1)
IN_MGT_1_N: BackplaneConnector (J1.B40), SDI (C26.1 R18.1)
IN_MGT_1_P: BackplaneConnector (J1.B39), SDI (C28.1 R20.1)
LVDS_IN_0_N: BackplaneConnector (J1.B57), HDMI (C19.1)
LVDS_IN_0_P: BackplaneConnector (J1.B56), HDMI (C18.1)
LVDS_IN_1_N: BackplaneConnector (J1.B54), HDMI (C21.1)
LVDS_IN_1_P: BackplaneConnector (J1.B53), HDMI (C20.1)
LVDS_IN_2_N: BackplaneConnector (J1.B51), HDMI (C23.1)
LVDS_IN_2_P: BackplaneConnector (J1.B50), HDMI (C22.1)
LVDS_IN_3_N: BackplaneConnector (J1.B48), HDMI (C25.1)
LVDS_IN_3_P: BackplaneConnector (J1.B47), HDMI (C24.1)
OUT_MGT_0_N: BackplaneConnector (J1.A42), SDI (R24.2)
OUT_MGT_0_P: BackplaneConnector (J1.A41), SDI (R26.2)
OUT_MGT_1_N: BackplaneConnector (J1.A38), SDI (R18.2)
OUT_MGT_1_P: BackplaneConnector (J1.A37), SDI (R20.2)
SCL: BackplaneConnector (J1.A6), Supplies (IC1.2 IC6.4 IC10.2), SDI (IC9.3)
SDA: BackplaneConnector (J1.A4), Supplies (IC1.1 IC6.3 IC10.1), SDI (IC9.4)

## Assembly variants
Prototype: not fitted R37 R38